# Altium schematic sheet RobotCtrl.SchDoc
size 292 x 193 mm; Author: Power Lin; DocumentNumber: 2; SheetNumber: 1; SheetTotal: 4; Website: wiki-power.com
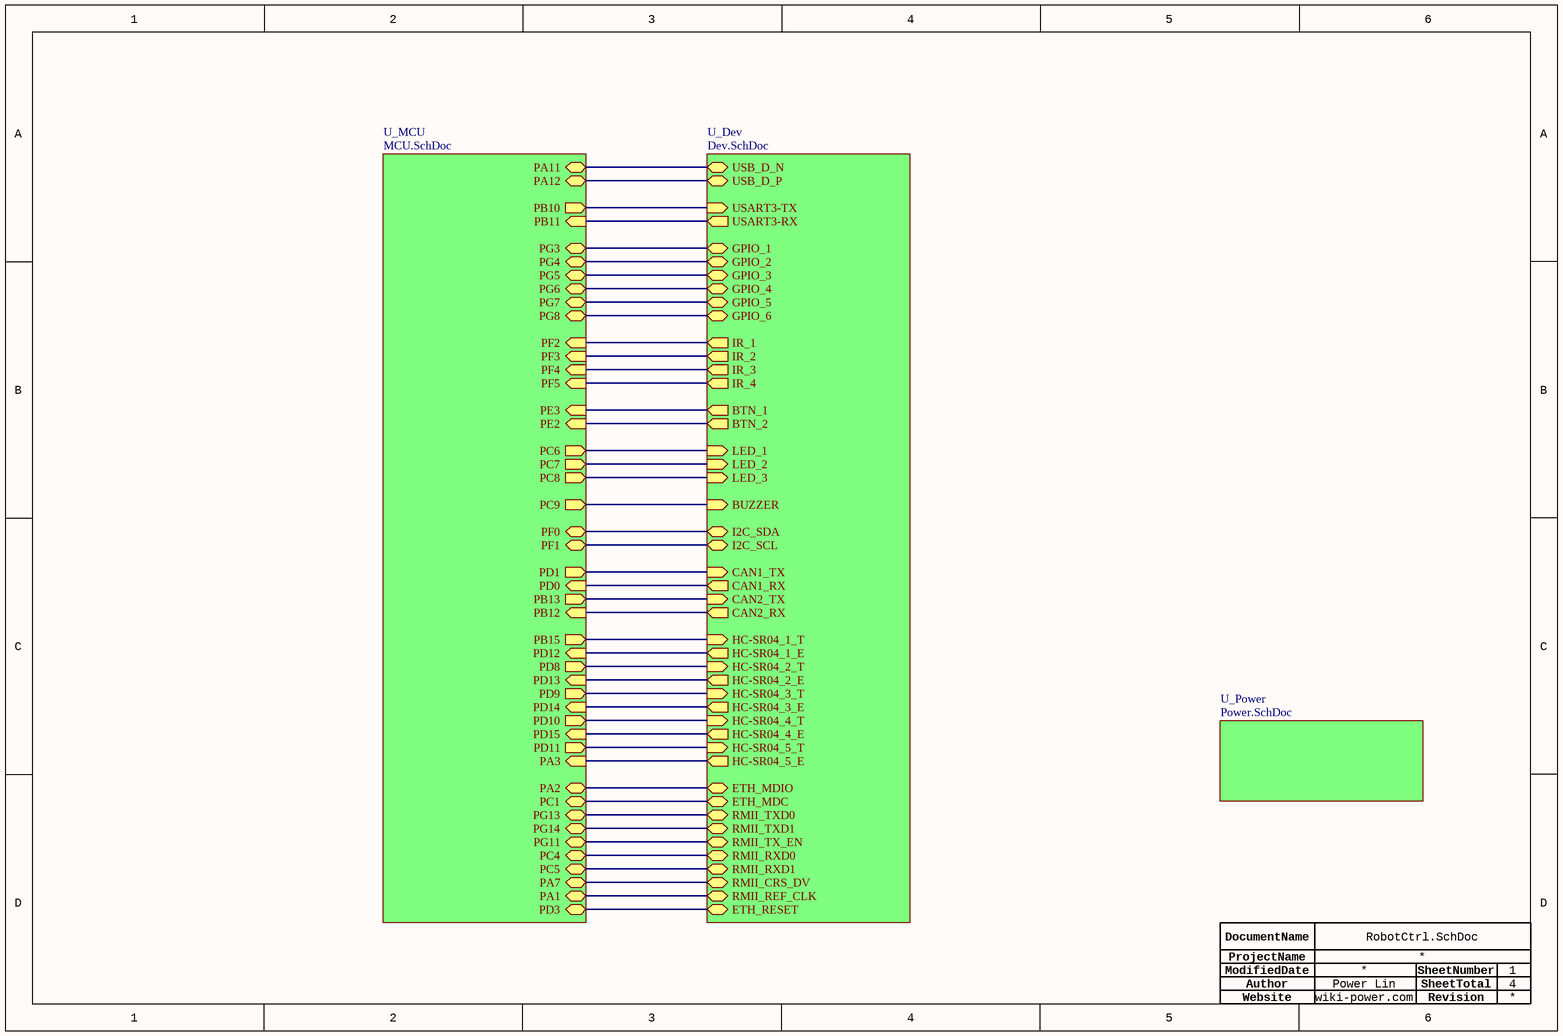
[diagram p0: RobotCtrl.SchDoc]

## Sub-sheets
U_Dev = Dev.SchDoc: USB_D_N (bidir), USB_D_P (bidir), USART3-TX (in), USART3-RX (out), GPIO_1 (bidir), GPIO_2 (bidir), GPIO_3 (bidir), GPIO_4 (bidir), GPIO_5 (bidir), GPIO_6 (bidir), BTN_1 (out), BTN_2 (out), LED_1 (in), LED_2 (in), LED_3 (in), IR_1 (out), IR_2 (out), IR_3 (out), IR_4 (out), BUZZER (in), I2C_SDA (bidir), I2C_SCL (bidir), CAN2_TX (in), CAN1_RX (out), CAN1_TX (in), CAN2_RX (out), HC-SR04_1_E (out), HC-SR04_2_T (in), HC-SR04_1_T (in), HC-SR04_5_E (out), HC-SR04_4_E (out), HC-SR04_5_T (in), HC-SR04_2_E (out), HC-SR04_4_T (in), HC-SR04_3_E (out), HC-SR04_3_T (in), RMII_TX_EN (bidir), RMII_TXD0 (bidir), ETH_RESET (bidir), RMII_TXD1 (bidir), RMII_RXD0 (bidir), RMII_RXD1 (bidir), ETH_MDIO (bidir), RMII_CRS_DV (bidir), ETH_MDC (bidir), RMII_REF_CLK (bidir)
U_MCU = MCU.SchDoc: PA11 (bidir), PA12 (bidir), PB11 (in), PB10 (out), PG8 (bidir), PG6 (bidir), PG5 (bidir), PG7 (bidir), PG4 (bidir), PG3 (bidir), PF3 (in), PF2 (in), PF5 (in), PF4 (in), PE3 (in), PE2 (in), PC7 (out), PC6 (out), PC8 (out), PC9 (out), PF0 (bidir), PF1 (bidir), PD0 (in), PB13 (out), PB12 (in), PD1 (out), PD10 (out), PA3 (in), PD8 (out), PD12 (in), PD15 (in), PD13 (in), PD11 (out), PD9 (out), PD14 (in), PB15 (out), PG11 (bidir), PC1 (bidir), PA7 (bidir), PA1 (bidir), PA2 (bidir), PG14 (bidir), PC4 (bidir), PD3 (bidir), PC5 (bidir), PG13 (bidir)
U_Power = Power.SchDoc: no entries

## Nets
(unnamed): sheet U_Dev/USB_D_N, sheet U_MCU/PA11
(unnamed): sheet U_Dev/USB_D_P, sheet U_MCU/PA12
(unnamed): sheet U_Dev/USART3-TX, sheet U_MCU/PB10
(unnamed): sheet U_Dev/USART3-RX, sheet U_MCU/PB11
(unnamed): sheet U_Dev/GPIO_1, sheet U_MCU/PG3
(unnamed): sheet U_Dev/GPIO_2, sheet U_MCU/PG4
(unnamed): sheet U_Dev/GPIO_3, sheet U_MCU/PG5
(unnamed): sheet U_Dev/GPIO_4, sheet U_MCU/PG6
(unnamed): sheet U_Dev/GPIO_5, sheet U_MCU/PG7
(unnamed): sheet U_Dev/GPIO_6, sheet U_MCU/PG8
(unnamed): sheet U_Dev/BTN_1, sheet U_MCU/PE3
(unnamed): sheet U_Dev/BTN_2, sheet U_MCU/PE2
(unnamed): sheet U_Dev/LED_1, sheet U_MCU/PC6
(unnamed): sheet U_Dev/LED_2, sheet U_MCU/PC7
(unnamed): sheet U_Dev/LED_3, sheet U_MCU/PC8
(unnamed): sheet U_Dev/IR_1, sheet U_MCU/PF2
(unnamed): sheet U_Dev/IR_2, sheet U_MCU/PF3
(unnamed): sheet U_Dev/IR_3, sheet U_MCU/PF4
(unnamed): sheet U_Dev/IR_4, sheet U_MCU/PF5
(unnamed): sheet U_Dev/BUZZER, sheet U_MCU/PC9
(unnamed): sheet U_Dev/I2C_SDA, sheet U_MCU/PF0
(unnamed): sheet U_Dev/I2C_SCL, sheet U_MCU/PF1
(unnamed): sheet U_Dev/CAN2_TX, sheet U_MCU/PB13
(unnamed): sheet U_Dev/CAN1_RX, sheet U_MCU/PD0
(unnamed): sheet U_Dev/CAN1_TX, sheet U_MCU/PD1
(unnamed): sheet U_Dev/CAN2_RX, sheet U_MCU/PB12
(unnamed): sheet U_Dev/HC-SR04_1_E, sheet U_MCU/PD12
(unnamed): sheet U_Dev/HC-SR04_2_T, sheet U_MCU/PD8
(unnamed): sheet U_Dev/HC-SR04_1_T, sheet U_MCU/PB15
(unnamed): sheet U_Dev/HC-SR04_5_E, sheet U_MCU/PA3
(unnamed): sheet U_Dev/HC-SR04_4_E, sheet U_MCU/PD15
(unnamed): sheet U_Dev/HC-SR04_5_T, sheet U_MCU/PD11
(unnamed): sheet U_Dev/HC-SR04_2_E, sheet U_MCU/PD13
(unnamed): sheet U_Dev/HC-SR04_4_T, sheet U_MCU/PD10
(unnamed): sheet U_Dev/HC-SR04_3_E, sheet U_MCU/PD14
(unnamed): sheet U_Dev/HC-SR04_3_T, sheet U_MCU/PD9
(unnamed): sheet U_Dev/RMII_TX_EN, sheet U_MCU/PG11
(unnamed): sheet U_Dev/RMII_TXD0, sheet U_MCU/PG13
(unnamed): sheet U_Dev/ETH_RESET, sheet U_MCU/PD3
(unnamed): sheet U_Dev/RMII_TXD1, sheet U_MCU/PG14
(unnamed): sheet U_Dev/RMII_RXD0, sheet U_MCU/PC4
(unnamed): sheet U_Dev/RMII_RXD1, sheet U_MCU/PC5
(unnamed): sheet U_Dev/ETH_MDIO, sheet U_MCU/PA2
(unnamed): sheet U_Dev/RMII_CRS_DV, sheet U_MCU/PA7
(unnamed): sheet U_Dev/ETH_MDC, sheet U_MCU/PC1
(unnamed): sheet U_Dev/RMII_REF_CLK, sheet U_MCU/PA1

## Notes on the sheet
- Author
- DocumentName
- ModifiedDate
- ProjectName
- SheetNumber
- SheetTotal
- Website
- Revision